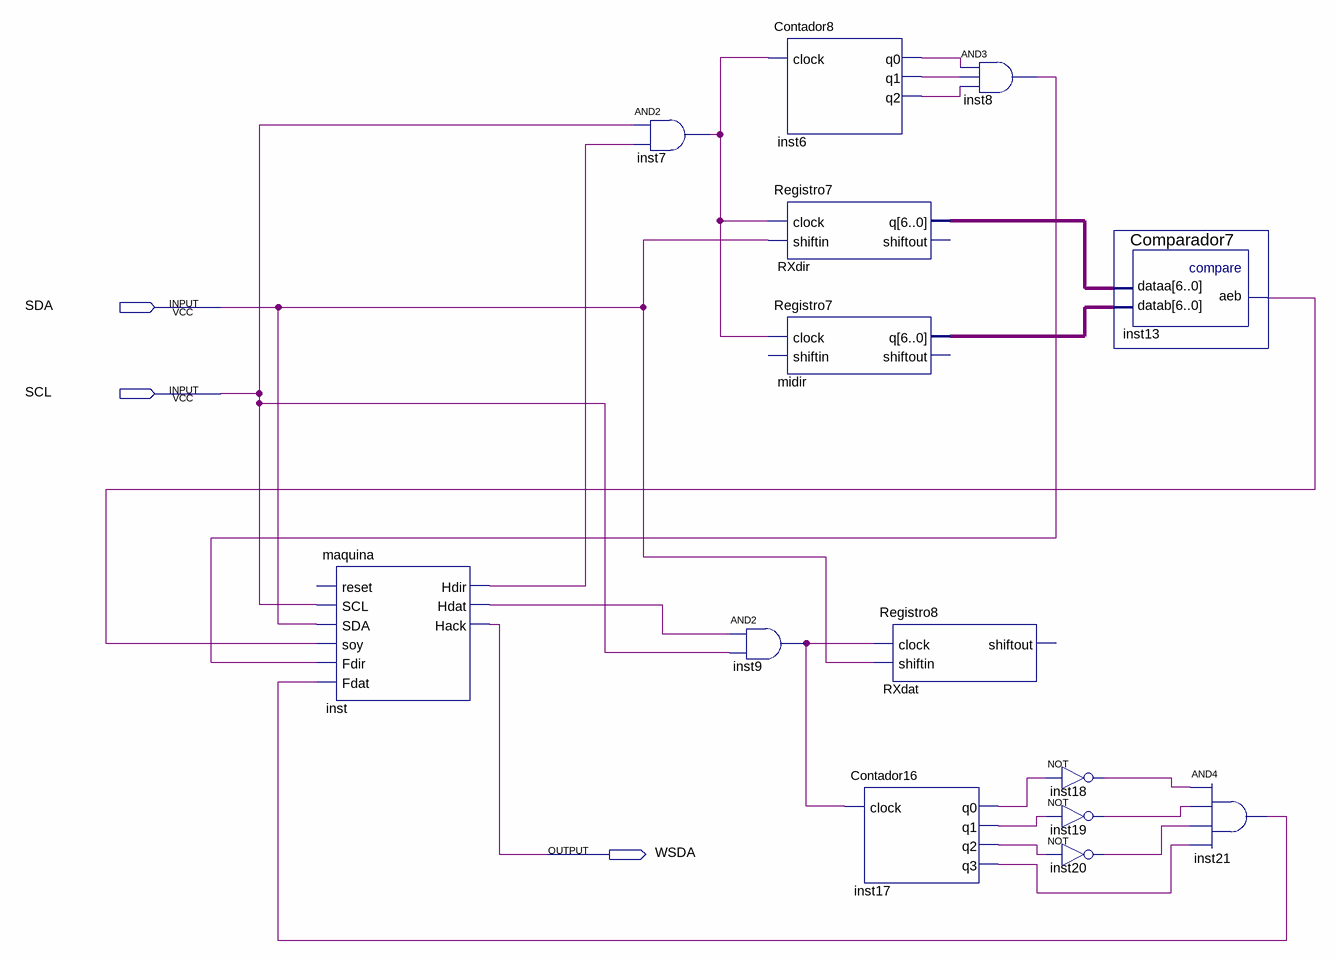
[diagram p0: schematic sheet]
// Quartus schematic circuito.bdf as structural Verilog: 14 symbols, 3 pins
module circuito (
  input  SDA,
  input  SCL,
  output WSDA
);

  wire inst6_q0, inst6_q1, inst6_q2, inst7_out, inst8_out, inst9_out, inst13_aeb, inst17_q0, inst17_q1,
       inst17_q2, inst17_q3, inst18_out, inst19_out, inst20_out, inst21_out, inst_hdat, inst_hdir;
  wire [6:0] midir_q, RXdir_q;

  maquina inst (
    .SCL(SCL), .SDA(SDA), .soy(inst13_aeb), .Fdir(inst8_out), .Fdat(inst21_out), .Hdir(inst_hdir),
    .Hdat(inst_hdat), .Hack(WSDA));  // open: reset
  and inst7 (inst7_out, SCL, inst_hdir);
  Contador8 inst6 (.clock(inst7_out), .q0(inst6_q0), .q1(inst6_q1), .q2(inst6_q2));
  Registro7 RXdir (.clock(inst7_out), .shiftin(SDA), .q(RXdir_q));  // open: shiftout
  Registro7 midir (.clock(inst7_out), .q(midir_q));  // open: shiftin, shiftout
  and inst9 (inst9_out, inst_hdat, SCL);
  Contador16 inst17 (.clock(inst9_out), .q0(inst17_q0), .q1(inst17_q1), .q2(inst17_q2), .q3(inst17_q3));
  Registro8 RXdat (.clock(inst9_out), .shiftin(SDA));  // open: shiftout
  and inst8 (inst8_out, inst6_q0, inst6_q1, inst6_q2);
  not inst18 (inst18_out, inst17_q0);
  not inst19 (inst19_out, inst17_q1);
  not inst20 (inst20_out, inst17_q2);
  Comparador7 inst13 (.dataa(RXdir_q), .datab(midir_q), .aeb(inst13_aeb));
  and inst21 (inst21_out, inst18_out, inst19_out, inst20_out, inst17_q3);
endmodule
